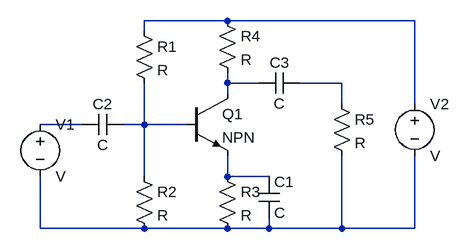
[diagram p0: schematic Draft7.asc]
Draft7.asc, the LTspice schematic file:
Version 4
SHEET 1 880 680
WIRE 256 32 128 32
WIRE 544 32 256 32
WIRE 128 48 128 32
WIRE 256 128 256 112
WIRE 304 128 256 128
WIRE 432 128 368 128
WIRE 256 144 256 128
WIRE 432 160 432 128
WIRE 544 160 544 32
WIRE 32 192 -32 192
WIRE 128 192 128 128
WIRE 128 192 96 192
WIRE 192 192 128 192
WIRE 128 272 128 192
WIRE 256 272 256 240
WIRE 320 272 256 272
WIRE -32 352 -32 272
WIRE 128 352 -32 352
WIRE 256 352 128 352
WIRE 320 352 320 336
WIRE 320 352 256 352
WIRE 432 352 432 240
WIRE 432 352 320 352
WIRE 544 352 544 240
WIRE 544 352 432 352
SYMBOL npn 192 144 R0
SYMATTR InstName Q1
SYMBOL res 112 32 R0
SYMATTR InstName R1
SYMBOL res 112 256 R0
SYMATTR InstName R2
SYMBOL res 240 256 R0
SYMATTR InstName R3
SYMBOL cap 304 272 R0
SYMATTR InstName C1
SYMBOL res 240 16 R0
SYMATTR InstName R4
SYMBOL cap 96 176 R90
WINDOW 0 0 32 VBottom 2
WINDOW 3 32 32 VTop 2
SYMATTR InstName C2
SYMBOL cap 368 112 R90
WINDOW 0 0 32 VBottom 2
WINDOW 3 32 32 VTop 2
SYMATTR InstName C3
SYMBOL voltage -32 176 R0
SYMATTR InstName V1
SYMBOL res 416 144 R0
SYMATTR InstName R5
SYMBOL voltage 544 144 R0
SYMATTR InstName V2

The netlist it stands for:
* Draft7.asc
Q1 N002 N005 N006 0 NPN
R1 N001 N005 R
R2 N005 N007 R
R3 N006 N007 R
C1 N006 N007 C
R4 N001 N002 R
C2 N005 N004 C
C3 N003 N002 C
V1 N004 N007 V
R5 N003 N007 R
V2 N001 N007 V
.model NPN NPN
.model PNP PNP
.lib standard.bjt
.backanno
.end